# Altium schematic sheet 3-HT16K33.SchDoc
size A4
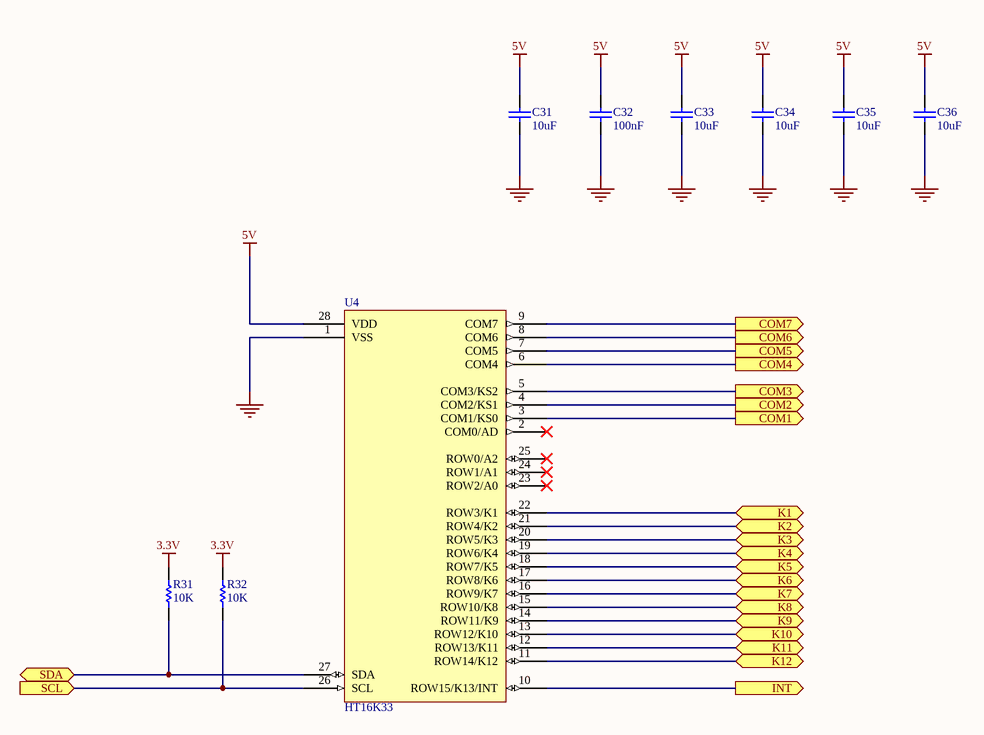
[diagram p0: 3-HT16K33.SchDoc]

## Parts
C31  10uF  [capa 1206]
C32  100nF  [capa 1206]
C33  10uF  [capa 1206]
C34  10uF  [capa 1206]
C35  10uF  [capa 1206]
C36  10uF  [capa 1206]
R31  10K  [RES 1206]
R32  10K  [RES 1206]
U4  HT16K33  [HT16K33 SOP]

## Ports
COM1 (out), COM2 (out), COM3 (out), COM4 (out), COM5 (out), COM6 (out), COM7 (out), INT (out), K1 (bidir), K2 (bidir), K3 (bidir), K4 (bidir), K5 (bidir), K6 (bidir), K7 (bidir), K8 (bidir), K9 (bidir), K10 (bidir), K11 (bidir), K12 (bidir), SCL (in), SDA (bidir)

## Nets
3.3V: R31.1 R32.2
5V: C31.2 C32.2 C33.2 C34.2 C35.2 C36.2 U4.28(VDD)
GND: C31.1 C32.1 C33.1 C34.1 C35.1 C36.1 U4.1(VSS)
COM1: U4.3(COM1/KS0) ; port COM1
COM2: U4.4(COM2/KS1) ; port COM2
COM3: U4.5(COM3/KS2) ; port COM3
COM4: U4.6(COM4) ; port COM4
COM5: U4.7(COM5) ; port COM5
COM6: U4.8(COM6) ; port COM6
COM7: U4.9(COM7) ; port COM7
INT: U4.10(ROW15/K13/INT) ; port INT
K1: U4.22(ROW3/K1) ; port K1
K2: U4.21(ROW4/K2) ; port K2
K3: U4.20(ROW5/K3) ; port K3
K4: U4.19(ROW6/K4) ; port K4
K5: U4.18(ROW7/K5) ; port K5
K6: U4.17(ROW8/K6) ; port K6
K7: U4.16(ROW9/K7) ; port K7
K8: U4.15(ROW10/K8) ; port K8
K9: U4.14(ROW11/K9) ; port K9
K10: U4.13(ROW12/K10) ; port K10
K11: U4.12(ROW13/K11) ; port K11
K12: U4.11(ROW14/K12) ; port K12
SCL: R32.1 U4.26(SCL) ; port SCL
SDA: R31.2 U4.27(SDA) ; port SDA

Not connected (* = marked no-connect by the designer): U4 2(COM0/AD)* 23(ROW2/A0)* 24(ROW1/A1)* 25(ROW0/A2)*

## Library data of the parts
C31 C33-C36 = Cap: Capacitor; Fabricant: MULTICOMP; Fournisseur: Farnell; RefFabricant: MC1206X106K160CT; RefFournisseur: 2320922
C32 = Cap: Capacitor; Fabricant: MULTICOMP; Fournisseur: Farnell; RefFabricant: MC1206B104K500CT; RefFournisseur: 1759361
R31 R32 = Res1: Resistor
U4 = HT16K33: Fabricant: Holtek; Fournisseur: AliExpress; RefFabricant: HT16K33-28SOP; RefFournisseur: N/A